# Altium schematic sheet ExternalIO.SchDoc
size A4; Organization: Altium Limited; Address1: L3, 12a Rodborough Rd; Address2: Frenchs Forest; Address3: NSW; Address4: Australia 2086
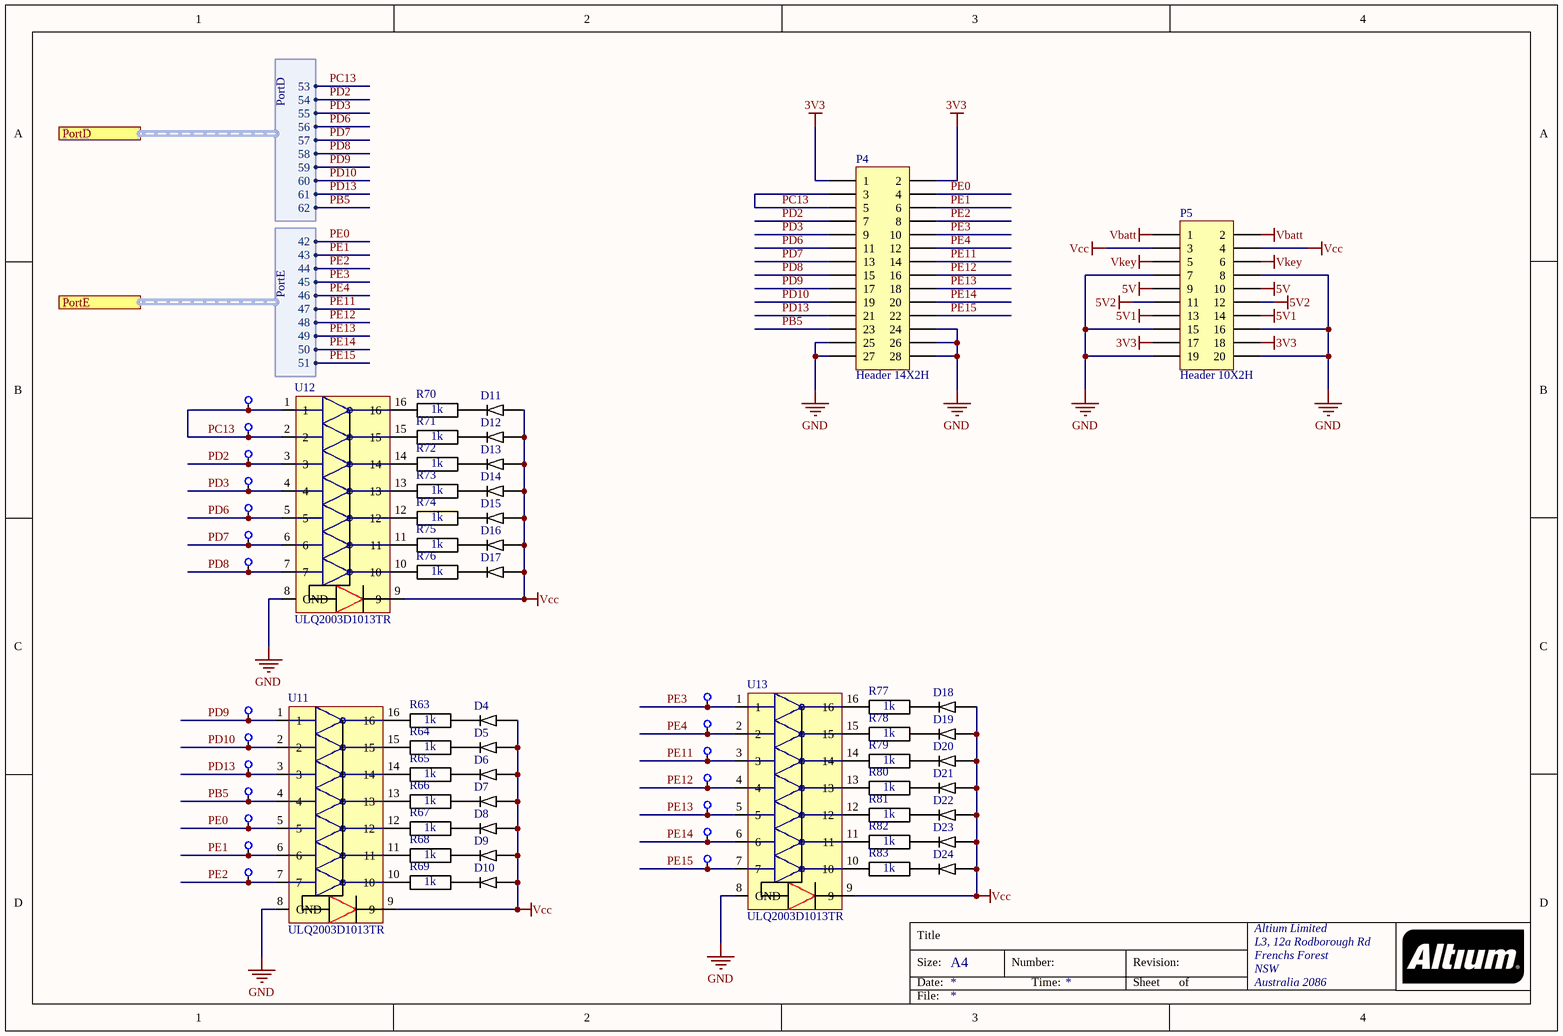
[diagram p0: ExternalIO.SchDoc]

## Parts
D4  LED  [LED 0805]  (value not drawn)
D5  LED  [LED 0805]  (value not drawn)
D6  LED  [LED 0805]  (value not drawn)
D7  LED  [LED 0805]  (value not drawn)
D8  LED  [LED 0805]  (value not drawn)
D9  LED  [LED 0805]  (value not drawn)
D10  LED  [LED 0805]  (value not drawn)
D11  LED  [LED 0805]  (value not drawn)
D12  LED  [LED 0805]  (value not drawn)
D13  LED  [LED 0805]  (value not drawn)
D14  LED  [LED 0805]  (value not drawn)
D15  LED  [LED 0805]  (value not drawn)
D16  LED  [LED 0805]  (value not drawn)
D17  LED  [LED 0805]  (value not drawn)
D18  LED  [LED 0805]  (value not drawn)
D19  LED  [LED 0805]  (value not drawn)
D20  LED  [LED 0805]  (value not drawn)
D21  LED  [LED 0805]  (value not drawn)
D22  LED  [LED 0805]  (value not drawn)
D23  LED  [LED 0805]  (value not drawn)
D24  LED  [LED 0805]  (value not drawn)
P4  Header 14X2H  [HDR2X14H]
P5  Header 10X2H  [HDR2X10H]
R63  1k  [SMD 0805]
R64  1k  [SMD 0805]
R65  1k  [SMD 0805]
R66  1k  [SMD 0805]
R67  1k  [SMD 0805]
R68  1k  [SMD 0805]
R69  1k  [SMD 0805]
R70  1k  [SMD 0805]
R71  1k  [SMD 0805]
R72  1k  [SMD 0805]
R73  1k  [SMD 0805]
R74  1k  [SMD 0805]
R75  1k  [SMD 0805]
R76  1k  [SMD 0805]
R77  1k  [SMD 0805]
R78  1k  [SMD 0805]
R79  1k  [SMD 0805]
R80  1k  [SMD 0805]
R81  1k  [SMD 0805]
R82  1k  [SMD 0805]
R83  1k  [SMD 0805]
TP69  TestPoint  [TESTPOINT]  (value not drawn)
TP70  TestPoint  [TESTPOINT]  (value not drawn)
TP71  TestPoint  [TESTPOINT]  (value not drawn)
TP72  TestPoint  [TESTPOINT]  (value not drawn)
TP73  TestPoint  [TESTPOINT]  (value not drawn)
TP74  TestPoint  [TESTPOINT]  (value not drawn)
TP75  TestPoint  [TESTPOINT]  (value not drawn)
TP76  TestPoint  [TESTPOINT]  (value not drawn)
TP77  TestPoint  [TESTPOINT]  (value not drawn)
TP78  TestPoint  [TESTPOINT]  (value not drawn)
TP79  TestPoint  [TESTPOINT]  (value not drawn)
TP80  TestPoint  [TESTPOINT]  (value not drawn)
TP81  TestPoint  [TESTPOINT]  (value not drawn)
TP82  TestPoint  [TESTPOINT]  (value not drawn)
TP83  TestPoint  [TESTPOINT]  (value not drawn)
TP84  TestPoint  [TESTPOINT]  (value not drawn)
TP85  TestPoint  [TESTPOINT]  (value not drawn)
TP86  TestPoint  [TESTPOINT]  (value not drawn)
TP87  TestPoint  [TESTPOINT]  (value not drawn)
TP88  TestPoint  [TESTPOINT]  (value not drawn)
TP89  TestPoint  [TESTPOINT]  (value not drawn)
U11  ULQ2003D1013TR  [SOIC127P600X175_HS-17M]
U12  ULQ2003D1013TR  [SOIC127P600X175_HS-17M]
U13  ULQ2003D1013TR  [SOIC127P600X175_HS-17M]

## Ports
PortD (harness PortD), PortE (harness PortE)

## Harnesses
PortD: 53, 54, 55, 56, 57, 58, 59, 60, 61, 62
PortE: 42, 43, 44, 45, 46, 47, 48, 49, 50, 51

## Nets
3V3: P4.1 P4.2 P5.17 P5.18
5V: P5.9 P5.10
5V1: P5.13 P5.14
5V2: P5.11 P5.12
GND: P4.24 P4.25 P4.26 P4.27 P4.28 P5.7 P5.8 P5.15 P5.16 P5.19 P5.20 U11.8(GND) U12.8(GND) U13.8(GND)
Vbatt: P5.1 P5.2
Vcc: D4.+ D5.+ D6.+ D7.+ D8.+ D9.+ D10.+ D11.+ D12.+ D13.+ D14.+ D15.+ D16.+ D17.+ D18.+ D19.+ D20.+ D21.+ D22.+ D23.+ D24.+ P5.3 P5.4 U11.9 U12.9 U13.9
Vkey: P5.5 P5.6
PB5: P4.23 TP79.0 U11.4 ; port PortD.62
PC13: P4.3 P4.5 TP69.0 TP70.0 U12.1 U12.2 ; port PortD.53
PD2: P4.7 TP71.0 U12.3 ; port PortD.54
PD3: P4.9 TP72.0 U12.4 ; port PortD.55
PD6: P4.11 TP73.0 U12.5 ; port PortD.56
PD7: P4.13 TP74.0 U12.6 ; port PortD.57
PD8: P4.15 TP75.0 U12.7 ; port PortD.58
PD9: P4.17 TP76.0 U11.1 ; port PortD.59
PD10: P4.19 TP77.0 U11.2 ; port PortD.60
PD13: P4.21 TP78.0 U11.3 ; port PortD.61
PE0: P4.4 TP80.0 U11.5 ; port PortE.42
PE1: P4.6 TP81.0 U11.6 ; port PortE.43
PE2: P4.8 TP82.0 U11.7 ; port PortE.44
PE3: P4.10 TP83.0 U13.1 ; port PortE.45
PE4: P4.12 TP84.0 U13.2 ; port PortE.46
PE11: P4.14 TP85.0 U13.3 ; port PortE.47
PE12: P4.16 TP86.0 U13.4 ; port PortE.48
PE13: P4.18 TP87.0 U13.5 ; port PortE.49
PE14: P4.20 TP88.0 U13.6 ; port PortE.50
PE15: P4.22 TP89.0 U13.7 ; port PortE.51
NetD4_-: D4.- R63.2
NetD5_-: D5.- R64.2
NetD6_-: D6.- R65.2
NetD7_-: D7.- R66.2
NetD8_-: D8.- R67.2
NetD9_-: D9.- R68.2
NetD10_-: D10.- R69.2
NetD11_-: D11.- R70.2
NetD12_-: D12.- R71.2
NetD13_-: D13.- R72.2
NetD14_-: D14.- R73.2
NetD15_-: D15.- R74.2
NetD16_-: D16.- R75.2
NetD17_-: D17.- R76.2
NetD18_-: D18.- R77.2
NetD19_-: D19.- R78.2
NetD20_-: D20.- R79.2
NetD21_-: D21.- R80.2
NetD22_-: D22.- R81.2
NetD23_-: D23.- R82.2
NetD24_-: D24.- R83.2
NetR63_1: R63.1 U11.16
NetR64_1: R64.1 U11.15
NetR65_1: R65.1 U11.14
NetR66_1: R66.1 U11.13
NetR67_1: R67.1 U11.12
NetR68_1: R68.1 U11.11
NetR69_1: R69.1 U11.10
NetR70_1: R70.1 U12.16
NetR71_1: R71.1 U12.15
NetR72_1: R72.1 U12.14
NetR73_1: R73.1 U12.13
NetR74_1: R74.1 U12.12
NetR75_1: R75.1 U12.11
NetR76_1: R76.1 U12.10
NetR77_1: R77.1 U13.16
NetR78_1: R78.1 U13.15
NetR79_1: R79.1 U13.14
NetR80_1: R80.1 U13.13
NetR81_1: R81.1 U13.12
NetR82_1: R82.1 U13.11
NetR83_1: R83.1 U13.10

## Notes on the sheet
- Title
- Size:
- Date:
- A4
- Number:
- Time:
- Revision:
- Sheet
- of
- File:

## Library data of the parts
D4-D24 = LED: LTST-C171GKT; pin to pad: +>2 ->1
P4 = Header 14X2H: Header, 14-Pin, Dual row, Right Angle; LatestRevisionDate: 17-Jul-2002; LatestRevisionNote: Re-released for DXP Platform.; Publisher: Altium Limited
P5 = Header 10X2H: Header, 10-Pin, Dual row, Right Angle; LatestRevisionDate: 17-Jul-2002; LatestRevisionNote: Re-released for DXP Platform.; Publisher: Altium Limited
R63-R83 = Resistor: RC0805FR-071KL; Value: 1k
U11-U13 = ULN2003AIDR